# Altium schematic sheet Audio_Module.SchDoc: Audio Module
size A4; DocumentNumber: 9; SheetNumber: 9; SheetTotal: 51
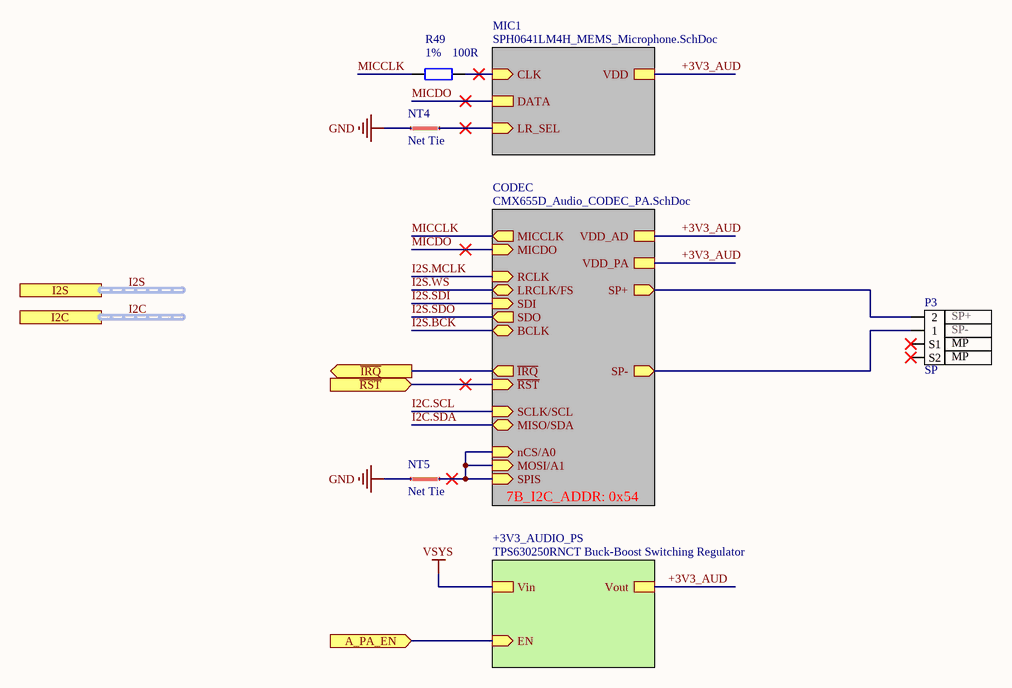
[diagram p0: Audio_Module.SchDoc]

## Parts
NT4  Net Tie  [Net Tie 6x30mil]  (net tie, no BOM)
NT5  Net Tie  [Net Tie 6x30mil]  (net tie, no BOM)
P3  SP  pin_1: SP+  pin_2: SP-  pin_MP1: MP  [CONN_JST_BM2B-SRSS-TB]
R49  Tolerance: 1%  Resistance: 100R  [R0402]  (hidden comment: RES SMD 100 OHM 1% 1/16W 0402)

## Sub-sheets
+3V3_AUDIO_PS = TPS630250RNCT Buck-Boost Switching Regulator: Vout, Vin, EN (in)
CODEC = CMX655D_Audio_CODEC_PA.SchDoc: SP+ (out), SP- (out), VDD_AD, VDD_PA, MICCLK (out), MICDO (in), ~{IRQ} (out), ~{RST} (in), SCLK/SCL (in), MISO/SDA (bidir), MOSI/A1 (in), nCS/A0 (in), SPIS (in), RCLK (in), LRCLK/FS (bidir), SDI (in), SDO (out), BCLK (bidir)  | 7B_I2C_ADDR: 0x54
MIC1 = SPH0641LM4H_MEMS_Microphone.SchDoc: CLK (in), DATA, VDD, LR_SEL (in)

## Ports
A_PA_EN (in), I2C (harness I2C), I2S (harness I2S), ~{IRQ} (out), ~{RST} (in)

## Nets
GND: NT4.1 NT5.1
VSYS: sheet +3V3_AUDIO_PS/Vin
+3V3_AUD: sheet MIC1/VDD, sheet CODEC/VDD_AD, sheet CODEC/VDD_PA, sheet +3V3_AUDIO_PS/Vout
~{IRQ}: port ~{IRQ}, sheet CODEC/~{IRQ}
~{RST}: port ~{RST}, sheet CODEC/~{RST}
A_PA_EN: port A_PA_EN, sheet +3V3_AUDIO_PS/EN
I2C.SCL: sheet CODEC/SCLK/SCL
I2C.SDA: sheet CODEC/MISO/SDA
I2S.BCK: sheet CODEC/BCLK
I2S.MCLK: sheet CODEC/RCLK
I2S.SDI: sheet CODEC/SDI
I2S.SDO: sheet CODEC/SDO
I2S.WS: sheet CODEC/LRCLK/FS
MICCLK: R49.2 ; sheet CODEC/MICCLK
MICDO: sheet MIC1/DATA, sheet CODEC/MICDO
NetNT4_2: NT4.2 ; sheet MIC1/LR_SEL
NetNT5_2: NT5.2 ; sheet CODEC/MOSI/A1, sheet CODEC/nCS/A0, sheet CODEC/SPIS
NetP3_1: P3.1 ; sheet CODEC/SP-
NetP3_2: P3.2 ; sheet CODEC/SP+
NetR49_1: R49.1 ; sheet MIC1/CLK

Not connected (* = marked no-connect by the designer): P3 S1* S2*

## Buses and harness runs
harness I2C = port I2C
harness I2S = port I2S

## Notes on the sheet
- Title
- Size:
- Date:
- A4
- Number:
- Time:
- Revision:
- Sheet
- of
- File:

## Library data of the parts
NT4 NT5 = Net Tie Line: ClassName: Net Tie
P3 = CONN HEADER SMD 2POS 1MM: Connector Header Surface Mount 2 position 0.039" (1.00mm); Manufacturer: JST; Manufacturer Part Number: BM02B-SRSS-TB(LF)(SN); Number of Positions: 2; Gender: Male; Current Rating: 1A; Contact Resistance: 30mR; Voltage Rating: 50V; Pitch: 1mm; Supplier 1: Digi-Key; Stock 1: 136465; Pricing 1: 1=0.51, 10=0.481, 100=0.3688, 500=0.3207 (USD); Mount: Surface Mount; Contact Plating: Tin,Copper; Contact Material: Brass,Tin; Color: Natural; Housing Color: Beige; Housing Material: Polyamide; Min Operating Temperature: -25°C; Max Operating Temperature: 85°C; Termination: Solder; Number of Rows: 1; Packaging: Tape and Reel; Fastening Type: Detent; Number of Contacts: 2; Connector Type: Header; Orientation: Right Angle; Max Current Rating: 1A; Max Voltage Rating (AC): 50V; Lead Free: Lead Free; Flammability Rating: UL94 V-0; ComponentLink1URL: https://www.digikey.com/en/products/detail/jst-sales-america-inc/BM02B-SRSS-TB-LF-SN/926694; ComponentLink1Description: https://www.digikey.com/en/products/detail/jst-sales-america-inc/BM02B-SRSS-TB-LF-SN/926694; Supplier Part Number 1: 455-1788-2-ND; Contact Shape: Circular; Insulation Material: Nylon; Insulation Color: Natural; Contact Finish - Mating: TIN; Series: BM02B-SR; Contact Type: Male Pin; Max Voltage Rating (DC): 50V; pin_MP2: MP
R49 = RES SMD 100 OHM 1% 1/16W 0402: 100 Ohms ±1% 0.063W, 1/16W Chip Resistor 0402 (1005 Metric) Moisture Resistant Thick Film; Manufacturer: Yageo; Manufacturer Part Number: RC0402FR-07100RL; Power Rating: 62.5mW; Voltage Rating: 50V; Temperature Coefficient: 100ppm/°C; Supplier 1: Digi-Key; Stock 1: 16989760; Pricing 1: 1=0.1, 10=0.016, 100=0.0064, 1000=0.0029, 2500=0.0025, 5000=0.0021 (USD); Case/Package: 0402; Number of Pins: 2; Case Code (Imperial): 0402; Case Code (Metric): 1005; Min Operating Temperature: -55°C; Max Operating Temperature: 155°C; Voltage Rating (DC): 50V; Packaging: Tape and Reel; Termination: SMD/SMT; Composition: Thick Film; Military Standard: Not; Length: 1mm; Height: 0.32mm; Width: 0.5mm; Depth: 0.5mm; REACH SVHC: No SVHC; Lead Free: Lead Free; ComponentLink1URL: http://www.farnell.com/datasheets/2167052.pdf?src-supplier=Element14; ComponentLink1Description: http://www.farnell.com/datasheets/2167052.pdf?src-supplier=Element14; ComponentLink2URL: http://www.yageo.com/documents/recent/PYu-RC_Group_51_RoHS_L_9.pdf?src-supplier=Mouser; ComponentLink2Description: http://www.yageo.com/documents/recent/PYu-RC_Group_51_RoHS_L_9.pdf?src-supplier=Mouser; ComponentLink3URL: http://www.yageo.com/documents/recent/PYu-RC0402_51_RoHS_L_6_r.pdf?src-supplier=Future+Electronics; ComponentLink3Description: http://www.yageo.com/documents/recent/PYu-RC0402_51_RoHS_L_6_r.pdf?src-supplier=Future+Electronics; ComponentLink4URL: https://www.verical.com/server-webapp/html/getDatasheet?partID=329466&src-supplier=Verical; ComponentLink4Description: https://www.verical.com/server-webapp/html/getDatasheet?partID=329466&src-supplier=Verical; ComponentLink5URL: http://www.farnell.com/datasheets/1018594.pdf?src-supplier=Element14; ComponentLink5Description: http://www.farnell.com/datasheets/1018594.pdf?src-supplier=Element14; ComponentLink6URL: http://documents.rs-components.com/techlib://itc_doclist_GB.htm?stockno=6185810&src-supplier=RSComponents; ComponentLink6Description: http://documents.rs-components.com/techlib://itc_doclist_GB.htm?stockno=6185810&src-supplier=RSComponents; Supplier Part Number 1: 311-100LRDKR-ND